# EAGLE design fpgaConfig (EAGLE 4.16)
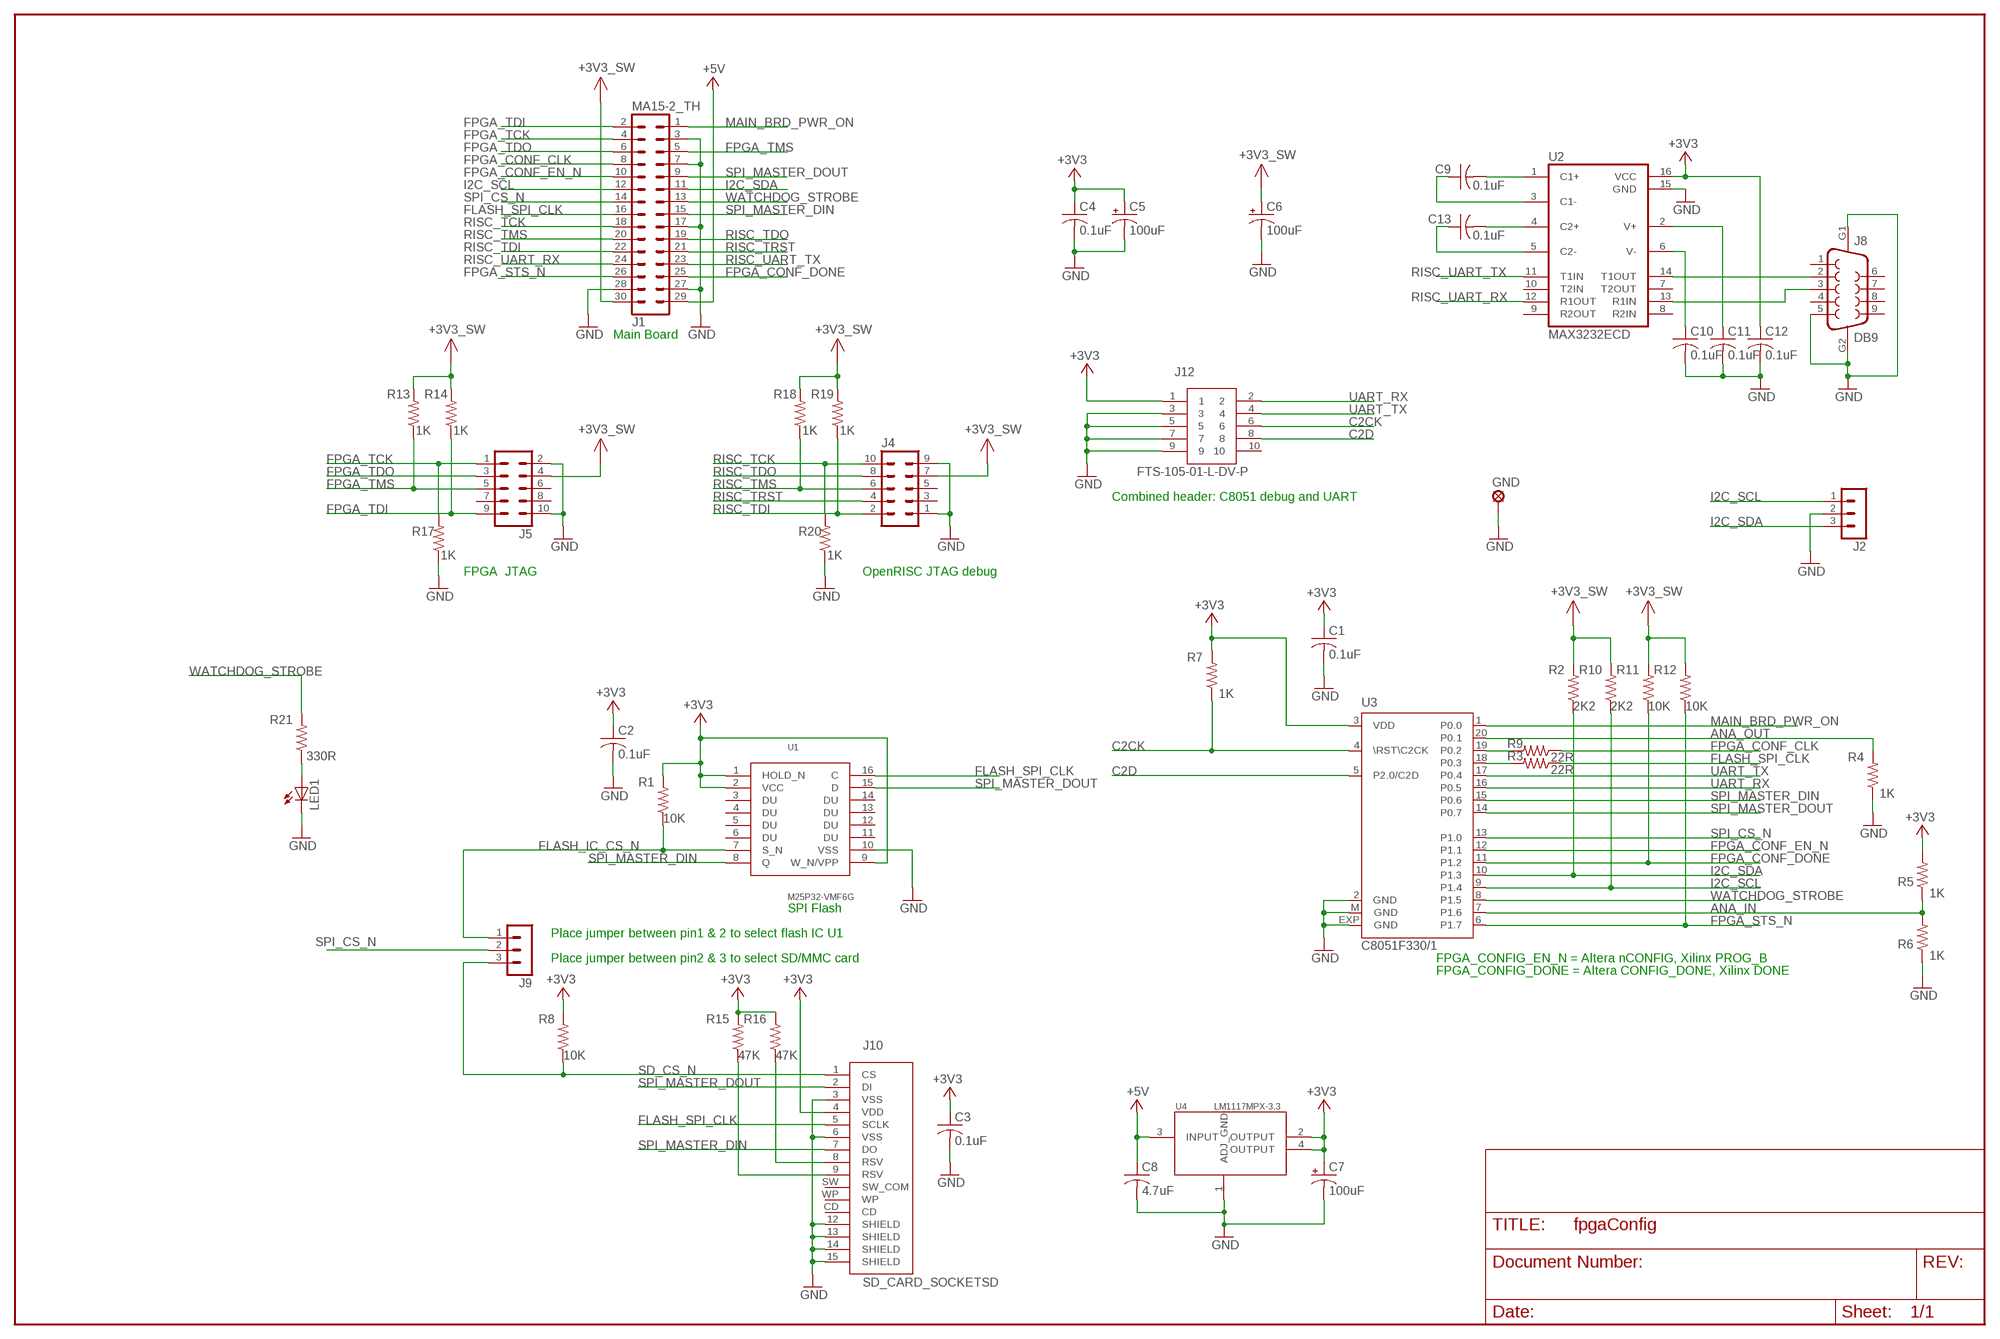
[diagram p0: schematic, sheet 1]

## Parts
C1  0.1uF  C-USC0603  [C0603]
C2  0.1uF  C-USC0603  [C0603]
C3  0.1uF  C-USC0603  [C0603]
C4  0.1uF  C-USC0603  [C0603]
C5  100uF  CPOL-USCT3528  [CT3528]
C6  100uF  CPOL-USCT3528  [CT3528]
C7  100uF  CPOL-USCT3528  [CT3528]
C8  4.7uF  C-USC0805  [C0805]
C9  0.1uF  C-USC0603  [C0603]
C10  0.1uF  C-USC0603  [C0603]
C11  0.1uF  C-USC0603  [C0603]
C12  0.1uF  C-USC0603  [C0603]
C13  0.1uF  C-USC0603  [C0603]
GND  LSP10  [LSP10]
J1  MA15-2_TH  [MA15-2_TH]
J2  MA03-1  [MA03-1]
J4  MA05-2  [MA05-2]
J5  MA05-2  [MA05-2]
J8  DB9  [DB9]
J9  MA03-1  [MA03-1]
J10  SD_CARD_SOCKETSD  [SD-MMC_SOCKET-PP]
J12  FTS-105-01-L-DV-P  [FTS-105-01-L-DV-P]
LED1  LEDCHIP-LED0603  [CHIP-LED0603]
R1  10K  R-US_R0603  [R0603]
R2  2K2  R-US_R0603  [R0603]
R3  22R  R-US_R0603  [R0603]
R4  1K  R-US_R0603  [R0603]
R5  1K  R-US_R0603  [R0603]
R6  1K  R-US_R0603  [R0603]
R7  1K  R-US_R0603  [R0603]
R8  10K  R-US_R0603  [R0603]
R9  22R  R-US_R0603  [R0603]
R10  2K2  R-US_R0603  [R0603]
R11  10K  R-US_R0603  [R0603]
R12  10K  R-US_R0603  [R0603]
R13  1K  R-US_R0603  [R0603]
R14  1K  R-US_R0603  [R0603]
R15  47K  R-US_R0603  [R0603]
R16  47K  R-US_R0603  [R0603]
R17  1K  R-US_R0603  [R0603]
R18  1K  R-US_R0603  [R0603]
R19  1K  R-US_R0603  [R0603]
R20  1K  R-US_R0603  [R0603]
R21  330R  R-US_R0603  [R0603]
U1  M25P32-VMF6G  [SO16]
U2  MAX3232ECD  [SO16_NARROW]
U3  C8051F330/1  [MLP20]
U4  LM1117MPX-3.3  [SOT223]

## Nets
+3V3: C1.1 C2.1 C3.1 C4.1 C5.+ C7.+ C12.1 J10.4(VDD) J12.1 R1.2 R5.2 R7.2 R8.2 R15.2 R16.2 U1.1(HOLD_N) U1.2(VCC) U1.9(W_N/VPP) U2.16(VCC) U3.3(VDD) U4.2(OUTPUT) U4.4(OUTPUT)
+3V3_SC: C6.+ J1.30 J4.7 J5.4 R2.2 R10.2 R11.2 R12.2 R13.2 R14.2 R18.2 R19.2 ; supply symbol labelled +3V3_SW
+5V: C8.1 J1.29 U4.3(INPUT)
ANA_IN: R5.1 R6.2 U3.7(P1.6)
ANA_OUT: R4.2 U3.20(P0.1)
C2CK: J12.6 R7.1 U3.4(\RST\C2CK)
C2D: J12.8 U3.5(P2.0/C2D)
FLASH_IC_CS_N: J9.1 R1.1 U1.7(S_N)
FLASH_SPI_CLK: J1.16 J10.5(SCLK) R3.1 U1.16(C)
FPGA_CONF_CLK: J1.8 R9.1
FPGA_CONF_DONE: J1.25 R11.1 U3.11(P1.2)
FPGA_CONF_EN_N: J1.10 U3.12(P1.1)
FPGA_STS_N: J1.26 R12.1 U3.6(P1.7)
FPGA_TCK: J1.4 J5.1 R17.2
FPGA_TDI: J1.2 J5.9 R14.1
FPGA_TDO: J1.6 J5.3
FPGA_TMS: J1.5 J5.5 R13.1
GND: C1.2 C2.2 C3.2 C4.2 C5.- C6.- C7.- C8.2 C10.2 C11.2 C12.2 GND.MP J1.3 J1.7 J1.17 J1.27 J1.28 J2.2 J4.1 J4.9 J5.2 J5.10 J8.5 J8.G1 J8.G2 J10.3(VSS) J10.6(VSS) J10.12(SHIELD) J10.13(SHIELD) J10.14(SHIELD) J10.15(SHIELD) J12.3 J12.5 J12.7 J12.9 LED1.C R4.1 R6.1 R17.1 R20.1 U1.10(VSS) U2.15(GND) U3.2(GND) U3.EXP(GND) U3.M(GND) U4.1(ADJ_GND)
I2C_SCL: J1.12 J2.1 R10.1 U3.9(P1.4)
I2C_SDA: J1.11 J2.3 R2.1 U3.10(P1.3)
MAIN_BRD_PWR_ON: J1.1 U3.1(P0.0)
N$1: J8.2 U2.14(T1OUT)
N$2: R9.2 U3.19(P0.2)
N$3: R3.2 U3.18(P0.3)
N$4: J8.3 U2.13(R1IN)
N$5: LED1.A R21.1
N$6: J10.8(RSV) R16.1
N$12: J10.9(RSV) R15.1
N$16: C9.2 U2.1(C1+)
N$17: C9.1 U2.3(C1-)
N$18: C13.2 U2.4(C2+)
N$19: C13.1 U2.5(C2-)
N$26: C10.1 U2.6(V-)
N$32: C11.1 U2.2(V+)
RISC_TCK: J1.18 J4.10 R20.2
RISC_TDI: J1.22 J4.2 R19.1
RISC_TDO: J1.19 J4.8
RISC_TMS: J1.20 J4.6 R18.1
RISC_TRST: J1.21 J4.4
RISC_UART_RX: J1.24 U2.12(R1OUT)
RISC_UART_TX: J1.23 U2.11(T1IN)
SD_CS_N: J9.3 J10.1(CS) R8.1
SPI_CS_N: J1.14 J9.2 U3.13(P1.0)
SPI_MASTER_DIN: J1.15 J10.7(DO) U1.8(Q) U3.15(P0.6)
SPI_MASTER_DOUT: J1.9 J10.2(DI) U1.15(D) U3.14(P0.7)
UART_RX: J12.2 U3.16(P0.5)
UART_TX: J12.4 U3.17(P0.4)
WATCHDOG_STROBE: J1.13 R21.2 U3.8(P1.5)
Unconnected: J4.3 J4.5 J5.6 J5.7 J5.8 J8.1 J8.4 J8.6 J8.7 J8.8 J8.9 J10.CD J10.SW(SW_COM) J10.WP J12.10 U1.3(DU) U1.4(DU) U1.5(DU) U1.6(DU) U1.11(DU) U1.12(DU) U1.13(DU) U1.14(DU) U2.7(T2OUT) U2.8(R2IN) U2.9(R2OUT) U2.10(T2IN)

## Notes on the sheet
- Main Board
- Combined header: C8051 debug and UART
- FPGA  JTAG | OpenRISC JTAG debug
- SPI Flash
- Place jumper between pin1 & 2 to select flash IC U1
- Place jumper between pin2 & 3 to select SD/MMC card | FPGA_CONFIG_EN_N = Altera nCONFIG, Xilinx PROG_B
- FPGA_CONFIG_DONE = Altera CONFIG_DONE, Xilinx DONE

## Library data of the parts
C1-C4 C8-C13 = rcl:C-US: CAPACITOR, American symbol
C5-C7 = rcl:CPOL-US: POLARIZED CAPACITOR, American symbol
GND = solpad:LSP10: SOLDER PAD drill 1.0 mm, distributor Buerklin, 12H555
J1 = base2designs:MA15-2_TH
J2 J9 = con-lstb:MA03-1: PIN HEADER
J4 J5 = con-lstb:MA05-2: PIN HEADER
J8 = base2designs:DB9: DB9 Connector Standard DB9 (D-Sub 9) serial connector. Can be used for CAN bus as well as RS485 and RS232. Footprint production proven. Spark Fun Electronics SKU : PType-DB9-PCB
J10 = base2designs:SD_CARD_SOCKET: SD/MMC Socket Media socket for SD and MMC cards. Push-push type. Schematic element and footprint production proven. Spark Fun Electronics SKU : PType-SDMMC
J12 = base2designs:FTS-105-01-L-DV-P: Samtec FTS series 0.05" 10-pin header
LED1 = led:LED: LED OSRAM: - CHIPLED LG R971, LG N971, LY N971, LG Q971, LY Q971, LO R971, LY R971 LH N974, LH R974 LS Q976, LO Q976, LY Q976 LO Q996 - Hyper CHIPLED LW Q18S LB Q993, LB Q99A, LB R99A - SideLED LS A670, LO A670, LY A670, LG A670, LP A670 LB A673, LV A673, LT A673, LW A673 LH A674 LY A675 LS A676, LA A676, LO A676, LY A676, LW A676 LS A679, LY A679, LG A679 - Hyper Micro SIDELED® LS Y876, LA Y876, LO Y876, LY Y876 LT Y87S - SmartLED LW L88C, LW L88S LB L89C, LB L89S, LG L890 LS L89K, LO L89K, LY L89K LS L896, LA L896, LO L896, LY L896 - TOPLED LS T670, LO T670, LY T670, LG T670, LP T670 LSG T670, LSP T670, LSY T670, LOP T670, LYG T670 LG T671, LOG T671, LSG T671 LB T673, LV T673, LT T673, LW T673 LH T674 LS T676, LA T676, LO T676, LY T676, LB T676, LH T676, LSB T676, LW T676 LB T67C, LV T67C, LT T67C, LS T67K, LO T67K, LY T67K, LW E67C LS E67B, LA E67B, LO E67B, LY E67B, LB E67C, LV E67C, LT E67C LW T67C LS T679, LY T679, LG T679 LS T770, LO T770, LY T770, LG T770, LP T770 LB T773, LV T773, LT T773, LW T773 LH T774 LS E675, LA E675, LY E675, LS T675 LS T776, LA T776, LO T776, LY T776, LB T776 LHGB T686 LT T68C, LB T68C - Hyper Mini TOPLED® LB M676 - Mini TOPLED Santana® LG M470 LS M47K, LO M47K, LY M47K Source: http://www.osram.convergy.de - LUMILED® LXK2-PW12-R00, LXK2-PW12-S00, LXK2-PW14-U00, LXK2-PW14-V00 LXK2-PM12-R00, LXK2-PM12-S00, LXK2-PM14-U00 LXK2-PE12-Q00, LXK2-PE12-R00, LXK2-PE12-S00, LXK2-PE14-T00, LXK2-PE14-U00 LXK2-PB12-K00, LXK2-PB12-L00, LXK2-PB12-M00, LXK2-PB14-N00, LXK2-PB14-P00, LXK2-PB14-Q00 LXK2-PR12-L00, LXK2-PR12-M00, LXK2-PR14-Q00, LXK2-PR14-R00 LXK2-PD12-Q00, LXK2-PD12-R00, LXK2-PD12-S00 LXK2-PH12-R00, LXK2-PH12-S00 LXK2-PL12-P00, LXK2-PL12-Q00, LXK2-PL12-R00 Source: www.luxeon.com
R1-R21 = rcl:R-US_: RESISTOR, American symbol
U1 = base2designs:M25P32-VMF6G
U2 = base2designs:MAX3232ECD
U3 = silabs:C8051F330*: 8kB ILP Flash MCU Family Source: www.silabs.com .. C8051F33x.pdf
U4 = base2designs:LM1117MPX-3.3

## Board
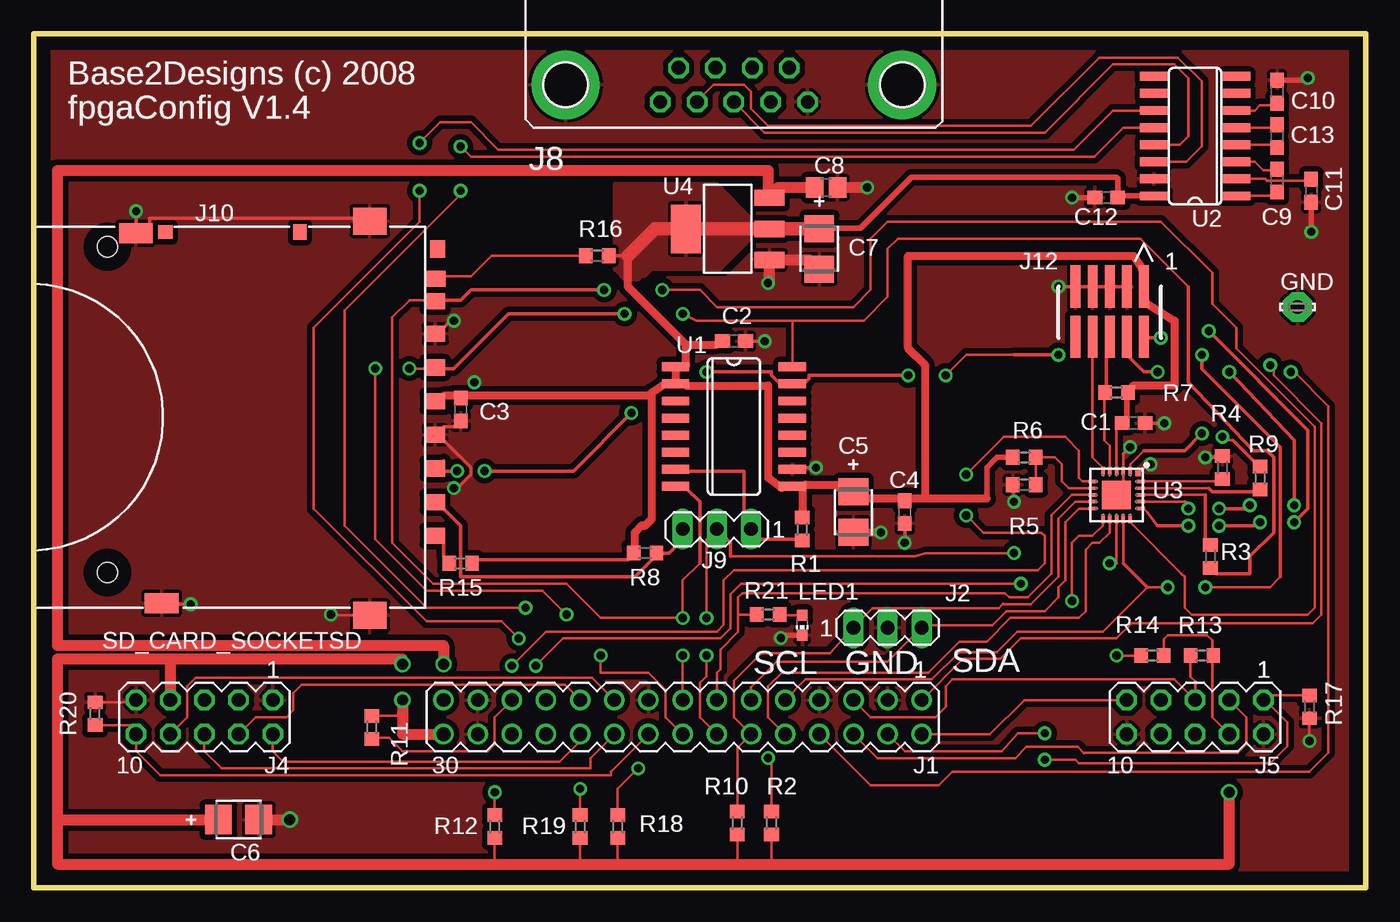
[diagram p1: board, top side]
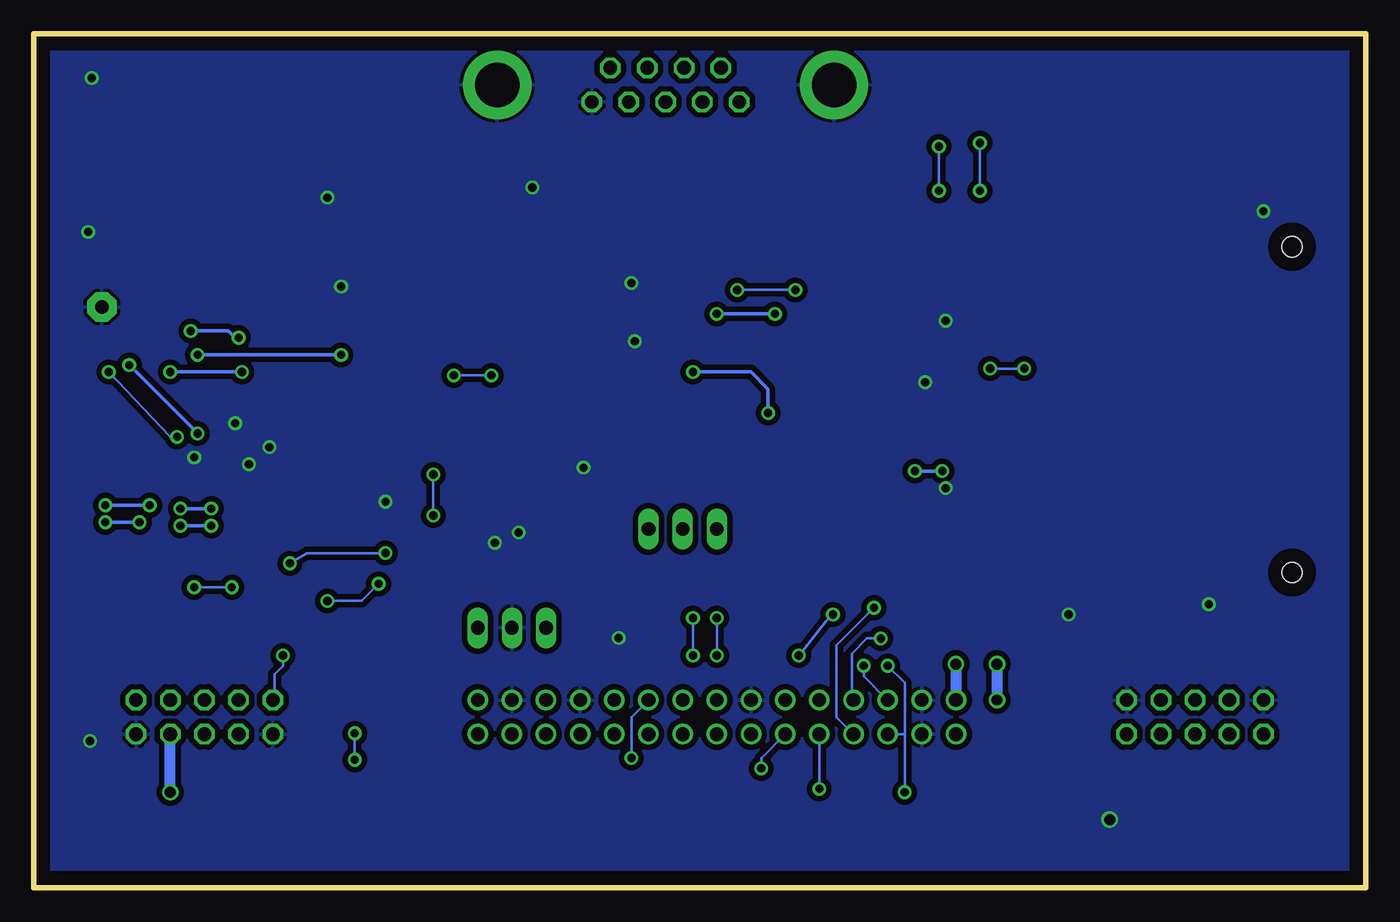
[diagram p2: board, bottom side, seen from below]

Size 99.06 x 63.5 mm. Coordinates in mm from the lower left corner, seen from the top.
Outline: 0,0 99.06,0 99.06,63.5 0,63.5 0,0
Copper layers (1*16): Top 0.035mm / dielectric 1.5mm / Bottom 0.035mm
Design rules "default": minimum track width 8mil, minimum drill 24mil, track to track 8mil, track to pad 8mil, pad to pad 8mil, via to via 8mil, smd to smd 8mil, copper to edge 40mil, drill to drill 8mil, minimum pad ring 10mil, minimum via ring 8mil, stop-mask expansion 3mil, vias tented up to drill 50mil, thermal gap 10mil

### Footprints (pad centres in the part's own frame; a part is rotated, then mirrored left to right if it is on the bottom)
C0603 = smd 1.1 x 1: 1 -0.85,0; 2 0.85,0
CT3528 = smd 2 x 2.2: + 1.5,0; - -1.5,0
C0805 = smd 1.3 x 1.5: 1 -0.85,0; 2 0.85,0
LSP10 = drill 1.016 pad 2.159 octagon: MP 0,0
MA15-2_TH = drill 1.016 pad 1.397 round: 1 -17.78,-1.27; 2 -17.78,1.27; 3 -15.24,-1.27; 4 -15.24,1.27; 5 -12.7,-1.27; 6 -12.7,1.27; 7 -10.16,-1.27; 8 -10.16,1.27; 9 -7.62,-1.27; 10 -7.62,1.27; 11 -5.08,-1.27; 12 -5.08,1.27; 13 -2.54,-1.27; 14 -2.54,1.27; 15 0,-1.27; 16 0,1.27; 17 2.54,-1.27; 18 2.54,1.27; 19 5.08,-1.27; 20 5.08,1.27; 21 7.62,-1.27; 22 7.62,1.27; 23 10.16,-1.27; 24 10.16,1.27; 25 12.7,-1.27; 26 12.7,1.27; 27 15.24,-1.27; 28 15.24,1.27; 29 17.78,-1.27; 30 17.78,1.27
MA03-1 = drill 1.016 long: 1 -2.54,0; 2 0,0; 3 2.54,0
MA05-2 = drill 1.016 octagon: 1 -5.08,-1.27; 2 -5.08,1.27; 3 -2.54,-1.27; 4 -2.54,1.27; 5 0,-1.27; 6 0,1.27; 7 2.54,-1.27; 8 2.54,1.27; 9 5.08,-1.27; 10 5.08,1.27
DB9 = drill 1.016 octagon: 1 -5.486,-1.27; 2 -2.743,-1.27; 3 0,-1.27; 4 2.743,-1.27; 5 5.486,-1.27; 6 -4.115,1.27; 7 -1.372,1.27; 8 1.372,1.27; 9 4.115,1.27 | drill 3.302 pad 5.08 round: G1 -12.522,0; G2 12.522,0
SD-MMC_SOCKET-PP = smd 1.2 x 1.5: 1 6.88,29.85; 2 4.38,29.85; 3 1.88,29.85; 4 -0.62,29.85; 5 -3.12,29.85; 6 -5.62,29.85; 7 -8.04,29.85; 8 -9.728,29.87; 9 9.38,29.85 | smd 1.5 x 2.5: 12 -13.1,7.6; 13 14.402,9.525 | smd 2 x 2.5: 14 -14,25; 15 15.3,25 | smd 1 x 1.05: CD -13.18,9.8 | smd 1.3 x 1.1: SW -11.938,30.048 | smd 1.15 x 1: WP -13.18,19.8 | hole 1.5: -12.1,5.5; 12.1,5.5
FTS-105-01-L-DV-P = smd 0.737 x 3.124: 1 0,0; 2 0,3.734; 3 1.27,0; 4 1.27,3.734; 5 2.54,0; 6 2.54,3.734; 7 3.81,0; 8 3.81,3.734; 9 5.08,0; 10 5.08,3.734
CHIP-LED0603 = smd 0.8 x 0.8: A 0,-0.75; C 0,0.75
R0603 = smd 1 x 1.1: 1 -0.85,0; 2 0.85,0
SO16 = smd 0.66 x 2.032: 1 -4.445,-4.343; 2 -3.175,-4.343; 3 -1.905,-4.343; 4 -0.635,-4.343; 5 0.635,-4.343; 6 1.905,-4.343; 7 3.175,-4.343; 8 4.445,-4.343; 9 4.445,4.343; 10 3.175,4.343; 11 1.905,4.343; 12 0.635,4.343; 13 -0.635,4.343; 14 -1.905,4.343; 15 -3.175,4.343; 16 -4.445,4.343
SO16_NARROW = smd 0.66 x 2.032: 1 -4.445,-3.073; 2 -3.175,-3.073; 3 -1.905,-3.073; 4 -0.635,-3.073; 5 0.635,-3.073; 6 1.905,-3.073; 7 3.175,-3.073; 8 4.445,-3.073; 9 4.445,3.073; 10 3.175,3.073; 11 1.905,3.073; 12 0.635,3.073; 13 -0.635,3.073; 14 -1.905,3.073; 15 -3.175,3.073; 16 -4.445,3.073
MLP20 = smd 0.6 x 0.254: 1 -1.8,1; 2 -1.8,0.5; 3 -1.8,0; 4 -1.8,-0.5; 5 -1.8,-1; 11 1.8,-1; 12 1.8,-0.5; 13 1.8,0; 14 1.8,0.5; 15 1.8,1 | smd 0.254 x 0.6: 6 -1,-1.8; 7 -0.5,-1.8; 8 0,-1.8; 9 0.5,-1.8; 10 1,-1.8; 16 1,1.8; 17 0.5,1.8; 18 0,1.8; 19 -0.5,1.8; 20 -1,1.8 | smd 2.15 x 2.15: EXP 0,0 | smd 0.435 x 0.435: M -1.6,1.6
SOT223 = smd 1.219 x 2.235: 1 -0.311,-0.099; 2 2,-0.099; 3 4.311,-0.099 | smd 3.6 x 2.2: 4 2,6.099

### Placement (x,y rotation side)
C1  81.79,34.54 0 top
C2  52.07,40.64 0 top
C3  31.75,35.56 270 top
C4  64.77,27.94 270 top
C5  60.96,27.94 90 top
C6  15.24,5.08 180 top
C7  58.42,47.5 90 top
C8  58.93,52.07 0 top
C9  92.46,52.58 270 top
C10  92.46,59.18 90 top
C11  95,51.82 270 top
C12  79.76,51.31 180 top
C13  92.46,55.88 270 top
GND  93.98,43.18 0 top
J1  48.26,12.7 180 top
J2  63.5,19.34 0 top
J4  12.7,12.7 180 top
J5  86.36,12.7 180 top
J8  52.07,59.69 0 top
J9  50.8,26.67 180 top
J10  0,35.56 270 top
J12  82.55,44.7 180 top
LED1  57.15,19.53 180 top
R1  57.15,26.67 90 top
R2  54.86,4.83 270 top
R3  87.5,24.64 90 top
R4  88.39,31.24 270 top
R5  73.66,32 180 top
R6  73.66,29.97 0 top
R7  80.52,36.83 0 top
R8  45.47,24.89 180 top
R9  91.19,30.48 270 top
R10  52.32,4.83 270 top
R11  25.15,11.94 90 top
R12  34.29,4.57 270 top
R13  86.87,17.27 0 top
R14  83.19,17.27 0 top
R15  31.75,24.13 0 top
R16  41.91,46.99 0 top
R17  94.87,13.46 90 top
R18  43.43,4.57 270 top
R19  40.64,4.57 270 top
R20  4.57,12.95 270 top
R21  54.61,20.32 180 top
U1  52.07,34.29 270 top
U2  86.36,55.88 90 top
U3  80.52,29.21 270 top
U4  54.61,46.99 90 top

### Tracks (layer width: path | path; a pad name or v marks a point on that pad's centre or on a via)
+3V3
  Top 0.203: 80.52,34.29 U3.3
  Top 0.254: 50.8,40.39 C2.1 | 48.51,38.86 U1.1 47.75,38.61 | 46.74,37.34 U1.2 | U1.2 47.75,37.59 | U1.9 57.15,29.72 | 64.52,28.96 C4.1 65.02,28.96 | U1.9 57.4,29.97 | 80.52,34.29 C1.1 81.28,34.8 | 81.28,36.32 R7.2 81.79,37.34 | J12.1 82.8,43.43 | U1.2 48.51,37.34 | 55.63,29.72 U1.9 | R15.2 33.02,24.38 44.2,24.38 R8.2 44.7,24.89 44.7,25.15 | 44.2,46.99 R16.2 | 31.5,36.58 C3.1 32,36.58 | 30.48,36.58 J10.4
  Top 0.406: 81.28,36.32 81.28,34.8 | 82.3,46.23 J12.1 | R5.2 71.63,32 70.87,31.24 70.87,28.96 | C7.+ 58.42,49.02 61.47,49.02 65.28,52.83 80.52,52.83 80.61,52.74 C12.1 80.52,51.31 80.64,51.44 U2.16
  Top 0.61: 48.51,40.39 50.8,40.39 | 48.51,38.86 48.51,40.39 | 46.74,37.34 45.97,36.83 45.97,36.58 | 47.75,37.59 47.75,38.61 | 44.2,46.99 44.2,44.7 48.51,40.39 | 57.15,29.72 R1.2 | 65.02,28.96 66.29,28.96 | 66.29,28.96 70.87,28.96 | 82.8,43.43 84.84,42.16 84.84,37.34 81.79,37.34 81.37,36.92 R7.2 | 82.3,46.23 81.79,46.99 65.02,46.99 65.02,40.13 66.29,38.86 66.29,28.96 | 48.51,37.34 54.61,37.34 54.61,30.48 55.63,29.72 | 45.97,36.58 45.97,27.43 45.47,26.92 45.21,26.92 44.7,26.42 44.7,25.15 44.62,25.06 | 31.5,36.58 30.48,36.58 | 45.97,36.58 32,36.58 | 57.4,29.97 60.2,29.97 60.96,29.21 | 60.96,29.21 C5.+ | 64.52,28.96 61.21,28.96 60.96,29.21
  Top 1.016: 55.12,49 55.12,48.99 U4.2 U4.4 | 55.12,49 C7.+ | 55.12,49 55.12,49.02 | U4.4 46.2,48.99 44.2,46.99 | U4.4 48.51,49.02
  pour Top (isolate 0.406): 53.52,49.6 50.8,52.32 43.18,52.32 43.18,46.08 arc45 43.25,45.9 43.94,45.21 44.85,45.21 arc45 45.03,45.29 45.21,45.47 45.36,45.47 arc45 45.54,45.54 45.97,45.97 50.95,45.97 arc45 51.13,46.05 53.59,48.51
+3V3_SC  (via drill 0.81)
  Top 0.203: R11.2 27.27,12.79 27.43,12.95 | 54.86,1.78 R2.2 | 52.32,1.78 R10.2 | 43.43,1.78 R18.2 | 40.64,1.78 R19.2 | 34.29,1.78 R12.2 | J5.4 87.63,12.7 87.63,17.14 87.76,17.27 R13.2 87.63,17.27 87.63,18.41 87.25,18.8 84.33,18.8 84.03,18.5 R14.2
  Top 0.813: 10.16,17.02 1.78,17.02 1.78,5.08 | 10.16,17.02 27.43,17.02 v27.43,16.64 | v27.43,13.97 27.43,12.95 27.43,11.43 J1.30 | v88.9,7.11 88.9,1.78 54.86,1.78 52.32,1.78 43.43,1.78 40.64,1.78 34.29,1.78 1.78,1.78 1.78,5.08 | 1.78,5.08 C6.+ | 10.16,17.02 J4.7
  Bottom 0.813: v27.43,16.64 v27.43,13.97 | 88.9,6.99 v88.9,7.11 J5.4
+5V  (via drill 0.81)
  Top 0.813: C8.1 55.37,52.07 54.61,51.31 54.61,53.34 1.78,53.34 1.78,18.03 30.48,18.03 v30.48,16.64
  Top 1.016: 54.61,51.31 54.62,51.3 U4.3
  Bottom 0.813: v30.48,16.64 J1.29
ANA_IN
  Top 0.203: U3.7 78.49,29.72 76.96,29.72 76.45,30.23 76.45,31.5 75.95,32 R5.1 74.42,32 74.51,31.92 R6.2
ANA_OUT
  Top 0.203: 87.88,30.23 82.55,30.23 U3.20
  Top 0.254: 87.88,30.23 R4.2
C2CK
  Top 0.203: U3.4 80.02,32.88 79.63,33.27 79.63,36.83 R7.1
  Top 0.254: R7.1 79.76,37.34 79.76,39.62 J12.6
C2D
  Top 0.203: U3.5 79.5,31.24 78.74,32 J12.8
FLASH_IC_CS_N
  Top 0.254: R1.1 56.64,25.91 53.85,25.91 J9.1 52.83,27.94 52.83,30.99 48.51,30.99 U1.7
FLASH_SPI_CLK  (via drill 0.61)
  Top 0.203: 87.63,23.62 87.5,23.75 R3.1 | 56.39,42.16 49.28,42.16 v48.26,42.67 | U1.16 56.41,42.14 56.39,42.16 | 56.39,42.16 61.72,42.16 63.5,43.94 63.5,47.5 64.26,48.26 82.3,48.26 85.85,44.7 | v42.16,17.27 42.16,16 45.72,16 46.99,14.73 46.99,12.7 J1.16 | J10.5 29.79,38.68 29.72,38.61 29.97,38.61 v27.94,38.61 | v39.62,20.32 37.85,22.1 29.21,22.1 25.4,25.91 v25.4,38.61
  Top 0.254: R3.1 87.88,23.37 90.42,23.37 90.42,24.64 92.2,26.42 92.2,32 91.69,32.51 90.68,32.51 85.85,37.59 85.85,44.7 | U1.16 55.63,38.86 | v43.94,42.67 35.31,42.67 31.24,38.61 29.97,38.61 29.9,38.68 J10.5
  Bottom 0.203: v42.16,17.27 40.13,19.81 v39.62,20.32 | v25.4,38.61 v27.94,38.61
  Bottom 0.254: v43.94,42.67 v48.26,42.67
FPGA_CONF_CLK  (via drill 0.61)
  Top 0.203: 89.15,33.27 88.65,33.27 v88.39,33.53 | v93.47,38.35 93.73,38.35 96.27,35.81 96.27,10.03 94.87,8.64 68.33,8.64 67.31,7.62 62.23,7.62 J1.8
  Top 0.254: 89.15,33.27 90.68,31.75 R9.1
  Bottom 0.203: v88.39,33.53 88.9,33.53 v93.47,38.35
FPGA_CONF_DONE  (via drill 0.61)
  Top 0.203: v73.41,22.61 52.58,22.61 51.82,21.84 51.82,19.3 51.05,18.54 39.37,18.54 v37.34,16.51 | U3.11 79.52,26.94 78.74,26.16 77.72,26.16 77.22,25.65 v77.22,21.34 | J1.25 34.29,12.7 34.29,10.67 33.78,10.16 27.43,10.16 26.42,11.18 25.15,11.18 R11.1
  Bottom 0.203: v77.22,21.34 74.68,21.34 v73.41,22.61 | v37.34,16.51 37.34,15.75 J1.25
FPGA_CONF_EN_N
  Top 0.203: U3.12 80.01,27.18 80.01,26.42 79.25,25.65 78.74,25.65 78.23,25.15 78.23,20.57 77.72,20.07 72.64,20.07 70.87,18.29 68.83,18.29 66.55,16 55.63,16 54.61,14.99 54.61,12.7 J1.10
FPGA_STS_N  (via drill 0.61)
  Top 0.203: U3.6 78.49,30.23 77.98,30.23 77.72,30.48 77.72,32.51 76.71,33.53 72.14,33.53 v69.34,30.73 | v69.34,27.69 70.61,26.42 74.93,26.42 75.18,26.16 75.18,24.13 74.68,23.62 52.07,23.62 51.31,22.86 51.31,19.56 50.8,19.05 38.1,19.05 v35.56,16.51 | R12.1 v34.29,7.11
  Bottom 0.203: v69.34,27.69 v69.34,30.73 | v35.56,16.51 34.29,15.24 34.29,11.43 | v34.29,7.11 34.29,11.43 | 34.29,11.43 J1.26
FPGA_TCK  (via drill 0.61)
  Top 0.203: J1.4 64.77,10.16 72.01,10.16 73.18,11.49 v75.18,11.49 | v75.18,9.53 77.47,9.53 77.72,9.27 91.95,9.27 93.22,10.54 93.22,12.32 91.57,13.97 | 91.57,13.97 91.44,14.1 J5.1 91.57,13.97 | R17.2 91.91,14.31 91.57,13.97
  Bottom 0.203: v75.18,11.49 v75.18,9.53
FPGA_TDI  (via drill 0.61)
  Top 0.203: J1.2 71.12,11.43 73.66,13.97 J5.9 | v80.52,17.27 R14.1
  Bottom 0.203: v80.52,17.27 80.52,16.51 81.15,15.88 81.15,14.1 J5.9
FPGA_TDO
  Top 0.203: J1.6 62.74,9.65 72.99,9.65 73.82,10.48 77.63,10.48 78.11,10 78.11,10.03 89.53,10.03 90.17,10.67 90.17,12.7 J5.3
FPGA_TMS
  Top 0.203: J1.5 62.23,12.7 67.06,12.7 67.82,13.46 67.82,14.99 68.33,15.49 84.84,15.49 J5.5 86.49,13.97 86.36,14.1 86.36,15.37 86.02,15.71 R13.1
GND  (via drill 0.61, 0.81)
  Top 0.203: J10.15 22.16,20.26 v22.1,20.32 | R20.1 7.62,13.8 J4.9 | R6.1 72.9,29.97 v72.9,28.7 | R17.1 v94.87,10.92 | 81.03,32.26 81.03,30.99 81.02,31 U3.2 81.02,29.71 U3.EXP
  Top 0.254: J12.3 J12.5 J12.7 J12.9 v76.2,44.7 | v83.06,31.5 82.55,31.24 U3.M | v87.12,32 87.88,32 R4.1 | C4.2 v64.77,25.65 | C2.2 v54.36,40.64 | C1.2 v84.07,34.54 | v58.17,31.24 57.4,31.24 U1.10 | 81.03,32.26 v81.53,32.77 | J10.3 30.48,33.78 | v11.68,21.08 10.67,21.08 J10.13 | v7.62,50.29 7.62,49.28 J10.12 8.64,49.28 8.64,49.78 23.88,49.78 J10.14 | C3.2 31.5,34.29 30.48,34.29 30.48,34.04 J10.3 | J10.6 30.48,41.66 30.99,42.16 v31.24,42.16 | J10.3 30.48,33.27 32.51,31.24 32.51,30.73 31.5,29.72 v31.24,29.72
  Top 0.406: C10.2 94.58,60.03 v94.74,60.2 | v77.22,51.31 C12.2 | 95,51.05 C11.2 v95,48.77 | LED1.C 55.77,18.78 v55.56,18.57
  Top 0.61: C5.- 62.97,26.44 v62.99,26.42
  Top 0.813: v54.61,44.96 54.71,45.06 U4.1 57.72,46.68 58.4,46 C7.- | C8.2 v61.98,52.07 | C6.- v19.05,5.08
  other vias: 32.77,37.59
  pour Bottom (isolate 0.406): 0,63.5 99.06,63.5 99.06,0 0,0
  pour Top (isolate 0.406, rank 2): 0,0 99.06,0 99.06,63.5 0,63.5
I2C_SCL
  Top 0.203: U3.9 78.49,28.7 77.47,28.7 76.2,27.43 76.2,23.11 74.17,21.08 72.1,21.08 72.07,21.11 71.75,20.8 62.39,20.8 60.96,19.37 | R10.1 52.32,10.41 J1.12 52.07,12.7 52.07,15.4 53.66,16.99 54.13,17.46 59.21,17.46 60.96,19.37 | 60.96,19.37 J2.1
I2C_SDA  (via drill 0.61)
  Top 0.203: U3.10 78.49,28.19 77.72,28.19 76.71,27.18 76.71,22.86 76.2,22.35 76.2,21.59 75.18,20.57 72.33,20.57 71.28,19.53 66.2,19.53 66.04,19.37 | R2.1 54.86,9.4 v54.61,9.65 | J1.11 53.34,14.92 55.24,16.83 63.5,16.83 66.04,19.37 | 66.04,19.37 J2.3
  Bottom 0.203: v54.61,9.65 54.61,12.7 J1.11
MAIN_BRD_PWR_ON  (via drill 0.61)
  Top 0.203: 82.55,32.51 81.53,31.5 81.53,31.24 U3.1 | v91.95,38.86 92.2,38.61 92.2,38.1 95.76,34.54 95.76,20.32 95.12,19.68 81.66,19.68 80.52,18.54 73.41,18.54 71.88,17.02 69.09,17.02 J1.1
  Top 0.254: 82.55,32.51 85.6,32.51 v86.87,33.78
  Bottom 0.203: v91.95,38.86 91.44,38.35
  Bottom 0.254: 91.44,38.35 v86.87,33.78
N$1
  Top 0.203: U2.14 85.72,53.98 86.87,55.12 86.87,59.94 85.09,61.72 79.25,61.72 74.17,56.64 54.61,56.64 53.34,57.91 53.34,59.18 52.83,59.69 50.55,59.69 49.28,58.42 J8.2
N$2
  Top 0.203: 87.38,29.72 82.55,29.72 U3.19
  Top 0.254: 87.38,29.72 87.63,29.46 90.68,29.46 R9.2
N$3
  Top 0.203: U3.18 87.12,29.21
  Top 0.254: 87.12,29.21 87.12,25.91 R3.2
N$4
  Top 0.203: U2.13 85.22,55.24 85.85,55.88 85.85,60.2 84.84,61.21 80.26,61.21 75.18,56.13 54.36,56.13 J8.3
N$5
  Top 0.203: R21.1 55.88,20.32 55.92,20.28 LED1.A
N$6
  Top 0.203: R16.1 34.04,46.99 32.51,45.47 29.72,45.47 29.87,45.31 J10.8
N$12
  Top 0.254: R15.1 30.48,24.64 30.48,25.65 J10.9
N$16
  Top 0.203: 92.46,51.82 92.71,52.07 | 92.46,51.82 C9.2 | U2.1 92.08,51.44 92.46,51.82
N$17
  Top 0.203: U2.3 90.81,53.98 91.44,53.34 92.71,53.34 92.62,53.43 C9.1
N$18
  Top 0.203: C13.2 92.46,55.12 92.33,55.24 U2.4
N$19
  Top 0.203: C13.1 92.46,56.9 92.08,56.52 U2.5
N$26
  Top 0.203: U2.6 90.81,57.78 91.19,58.17 92.46,58.17 C10.1
N$32
  Top 0.203: U2.2 91.57,52.7 91.69,52.58 94.74,52.58 95,52.83 C11.1
RISC_TCK
  Top 0.203: R20.2 7.62,12.1 J4.10 7.62,10.16 9.4,8.38 42.93,8.38 42.93,8.64 J1.18
RISC_TDI  (via drill 0.61)
  Top 0.203: v40.64,7.37 R19.1 | J1.22 40.64,10.92 39.12,9.4 18.54,9.4 17.78,10.16 J4.2
  Bottom 0.203: J1.22 v40.64,7.37
RISC_TDO
  Top 0.203: J4.8 11.43,12.7 11.43,14.99 12.06,15.62 41.53,15.62 J1.19
RISC_TMS  (via drill 0.61)
  Top 0.203: R18.1 43.43,7.37 v44.96,8.89 | J1.20 41.4,9.65 41.4,8.89 13.97,8.89 12.7,10.16 J4.6
  Bottom 0.203: v44.96,8.89 44.96,9.65 J1.20
RISC_TRST
  Top 0.203: J4.4 16.51,12.7 18.8,12.7 19.3,13.21 19.3,14.48 19.94,15.11 39.5,15.11 J1.21
RISC_UART_RX  (via drill 0.61)
  Top 0.203: v31.75,55.12 32.51,54.36 78.87,54.36 81.03,56.52 U2.12 | v31.75,51.82 31.75,51.56 23.11,42.93 23.11,26.92 29.21,20.83 v36.58,20.83 36.83,20.83 | 83.31,56.39 83.29,56.41 U2.12 | U2.12 83.31,56.52
  Bottom 0.203: J1.24 39.37,12.7 39.37,18.03 v36.58,20.83 | v31.75,51.82 v31.75,55.12
RISC_UART_TX  (via drill 0.61)
  Top 0.203: v28.7,55.37 30.23,56.9 32.51,56.9 34.54,54.86 77.34,54.86 80.26,57.78 83.19,57.78 | v28.7,51.82 28.7,49.53 20.83,41.66 20.83,28.19 29.21,19.81 34.8,19.81 v36.07,18.54 | 83.29,57.68 83.31,57.66 | 83.29,57.68 U2.11 83.19,57.78 | 83.19,57.78 83.29,57.68 | 83.19,57.78 83.06,57.91
  Bottom 0.203: v28.7,51.82 v28.7,55.37 | J1.23 38.23,14.1 38.23,17.4 37.08,18.54 v36.07,18.54
SD_CS_N
  Top 0.254: J9.3 47.75,25.4 47.24,24.89 R8.1 45.97,24.38 44.7,23.11 31.75,23.11 31.75,26.92 30.48,28.19 J10.1
SPI_CS_N  (via drill 0.61)
  Top 0.203: 80.52,24.13 U3.13 | 51.82,24.64 65.53,24.64 66.29,24.89 v72.9,24.89 | v50.04,17.27 50.04,15.75 49.53,15.24 49.53,12.7 J1.14 | v50.04,20.07 50.04,25.91 J9.2
  Top 0.254: v80.01,24.13 80.52,24.13 | 51.82,24.64 51.82,25.65 J9.2
  Bottom 0.203: v72.9,24.89 78.74,24.89 v80.01,24.13 | v50.04,17.27 v50.04,20.07
SPI_MASTER_DIN  (via drill 0.61)
  Top 0.203: U3.15 81.53,27.18 85.34,23.37 85.6,23.11 85.6,20.83 86.11,20.32 87.63,20.32 | J10.7 29.85,43.57 29.72,43.43 29.46,43.69 27.94,43.69 26.67,42.42 26.67,25.65 29.72,22.61 39.62,22.61 42.16,20.07 v48.26,20.07 48.26,22.86 49.53,24.13 | v46.74,44.45 49.53,44.45 50.8,43.18 60.96,43.18 62.23,44.45 62.23,48.26 63.5,49.53 83.82,49.53 87.63,45.72 87.63,43.43 89.41,41.66 89.41,40.13 95.25,34.29 95.25,20.83 94.74,20.32 87.63,20.32 | 87.63,20.32 87.38,20.32 | v48.26,17.27 J1.15
  Top 0.254: 49.53,24.13 49.53,28.7 48.51,29.72 U1.8 | v42.42,44.45 32.51,44.45 31.75,43.69 29.72,43.69 29.81,43.6 J10.7
  Bottom 0.203: v42.42,44.45 v46.74,44.45 | v48.26,20.07 v48.26,17.27
SPI_MASTER_DOUT  (via drill 0.61)
  Top 0.203: 81.03,24.13 81.03,27.18 U3.14 | 72.9,39.62 69.34,39.62 v67.82,38.1 | 29.97,31.24 29.91,31.18 J10.2 | v84.33,22.35 82.8,22.35 79.5,19.05 73.15,19.05 71.63,17.53 68.83,17.53 66.8,15.49 57.4,15.49 J1.9 | v87.12,22.35 91.95,22.35 92.71,23.11
  Top 0.254: 82.8,22.35 81.03,24.13 | v50.04,38.35 54.86,38.35 54.86,38.1 55.63,37.34 U1.15 57.4,37.59 57.66,37.85 57.66,38.1 v65.02,38.1 | 72.9,39.62 v76.2,39.62 | 92.71,23.11 92.71,32.77 86.87,38.61 v86.87,39.62 | 30.48,31.75 J10.2 30.48,30.99 v31.5,30.99 | v33.53,30.99 40.13,30.99 v44.45,35.31
  Bottom 0.203: v65.02,38.1 v67.82,38.1 | v87.12,22.35 v84.33,22.35
  Bottom 0.254: v50.04,38.35 46.48,38.35 45.72,38.35 44.45,37.08 v44.45,35.31 | v76.2,39.62 v86.87,39.62 | v31.5,30.99 v33.53,30.99
UART_RX  (via drill 0.61)
  Top 0.203: U3.16 82.55,28.19 82.8,27.94 83.57,26.92
  Top 0.254: 83.57,26.92 v85.85,26.92 | v93.73,27.18 94.74,28.19 94.74,34.04 v87.38,41.4 | J12.2 82.63,40.89 v83.82,40.89 | v91.19,27.18 91.19,26.92 v88.14,26.92
  Bottom 0.254: v85.85,26.92 v88.14,26.92 | v91.19,27.18 v93.73,27.18 | v83.82,40.89 84.07,40.89 84.58,41.4 v87.38,41.4
UART_TX  (via drill 0.61)
  Top 0.203: U3.17 85.59,28.71
  Top 0.254: 85.59,28.71 v85.85,28.19 | v93.73,28.45 93.73,33.27 v88.9,38.35 | v83.57,38.35 82.55,38.35 81.28,39.62 J12.4 | v88.14,28.19 90.17,28.19 v90.42,28.45
  Bottom 0.254: v85.85,28.19 v88.14,28.19 | v90.42,28.45 v93.73,28.45 | v88.9,38.35 v83.57,38.35
WATCHDOG_STROBE
  Top 0.203: U3.8 77.22,29.21 75.69,27.69 75.69,23.37 73.91,21.59 72.55,21.59 72.23,21.91 52.7,21.91 52.39,21.59 52.39,20.32 | J1.13 50.8,16 51.05,16.26 51.05,17.72 52.39,19.05 52.39,20.32 | 52.39,20.32 R21.2

### Text on the board
tPlace: Base2Designs (c) 2008 | fpgaConfig V1.4 | SCL | GND | SDA
_tsilk: Base2Designs (c) 2008 | C10 | fpgaConfig V1.4 | C13 | C11 | J8 | U4 | C8 | C12 | J10 | U2 | C9 | R16 | C7 | J12 | 1 | GND | C2 | U1 | R7 | C3 | R4 | C5 | C1 | R6 | R9 | C4 | U3 | R5 | 1 | R3 | J9 | R1 | R8 | R21 | R15 | LED1 | J2 | 1 | R14 | R13 | SD_CARD_SOCKETSD | 1 | 1 | 1 | SCL | GND | SDA | R20 | R17 | 10 | J4 | 30 | J1 | 10 | J5 | R11 | R10 | R2 | R12 | R19 | R18 | C6